# Altium schematic sheet ch347.SchDoc
size A4; SheetNumber: 1; SheetTotal: 1; SPICEModelCacheGGIMXJZP: <root> / <DocumentId>GGIMXJZP</DocumentId> / <CacheFrame Number="0"> / <Model Name="fuse" Kind="CKT"> / <Text>.SUBCKT FUSE 1 2 PARAMS: CURRENT=1 RESISTANCE=1m / SW1 1 2 3 0 SMOD OFF / BNLV 3 0 V=(abs(v(1,2))) / .MODEL SMOD SW (VT={(CURRENT*RESISTANCE)} RON=1g ROFF={RESISTANCE}) / .ENDS FUSE</Text> / </Model> / </CacheFrame> / </root>
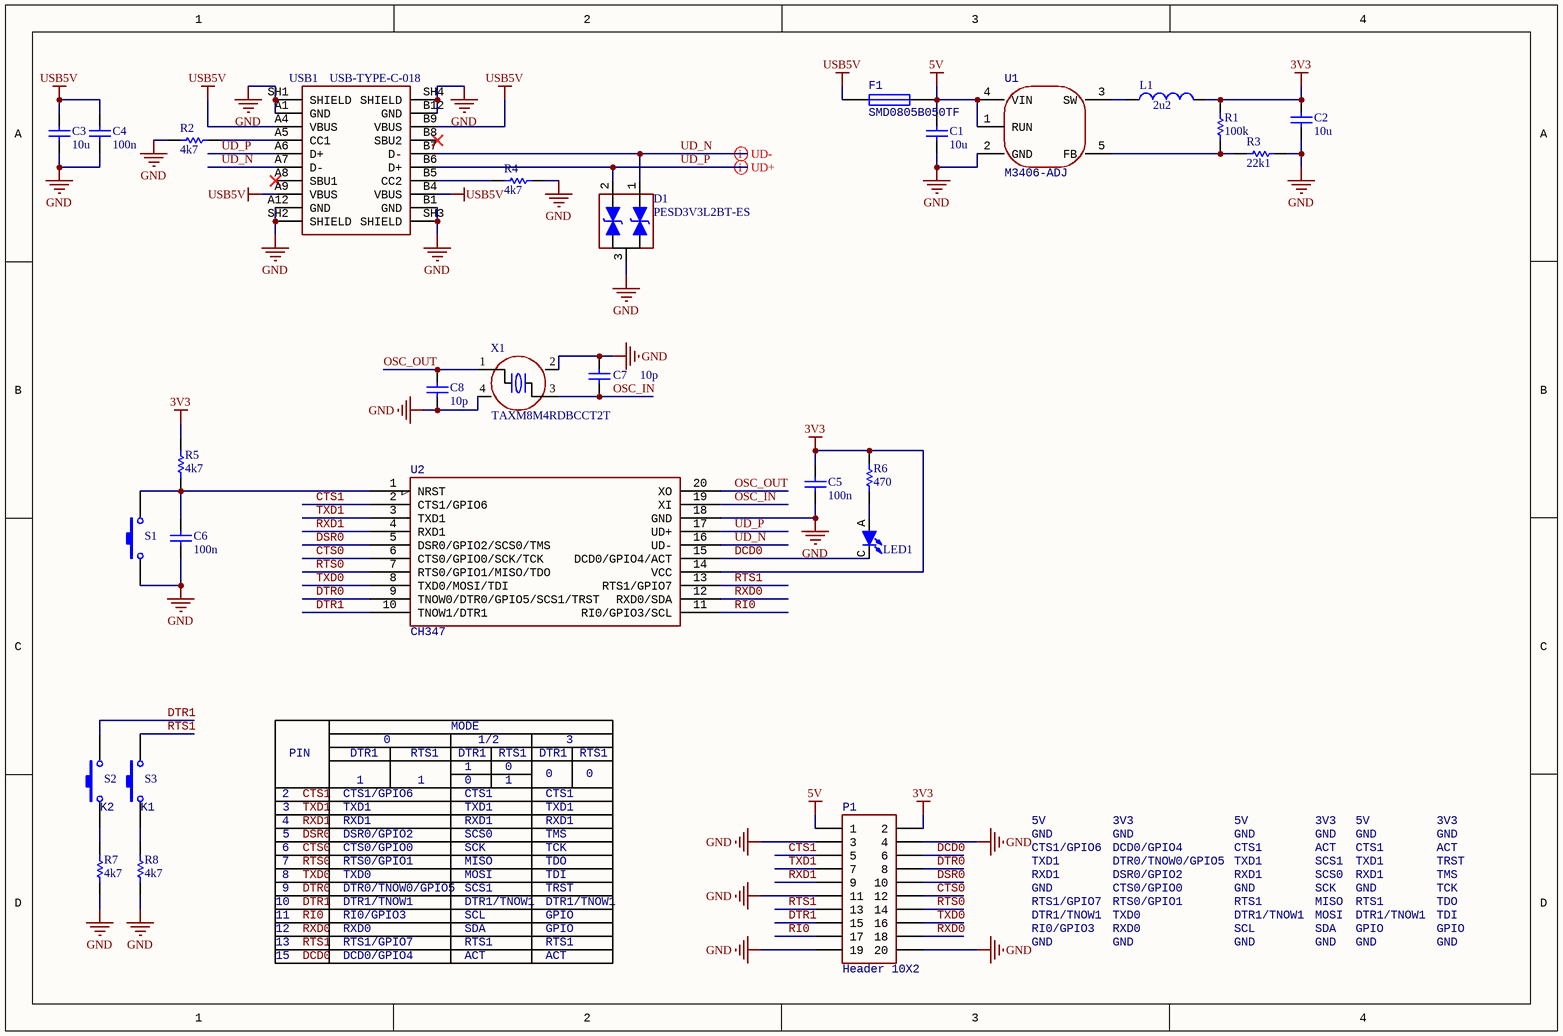
[diagram p0: ch347.SchDoc]

## Parts
C1  value 10u  [CAPC160X80X90L30N]  (hidden comment: Capacitor)
C2  value 10u  [CAPC160X80X90L30N]  (hidden comment: Capacitor)
C3  value 10u  [CAPC160X80X90L30N]  (hidden comment: Capacitor)
C4  value 100n  [CAPC100X50X55L25N]  (hidden comment: Capacitor)
C5  value 100n  [CAPC100X50X55L25N]  (hidden comment: Capacitor)
C6  value 100n  [CAPC100X50X55L25N]  (hidden comment: Capacitor)
C7  value 10p  [CAPC100X50X55L25N]  (hidden comment: Capacitor)
C8  value 10p  [CAPC100X50X55L25N]  (hidden comment: Capacitor)
D1  PESD3V3L2BT-ES  [SOT23-3P95_237X111L52X43N]
F1  SMD0805B050TF  [FUSC210X135X125L37N]
L1  value 2u2  [INDC200X160X105L60N]  (hidden comment: Inductor)
LED1  蓝灯 正贴  [LEDC100X50X45L25N]  (value not drawn)
P1  Header 10X2  [HDRV20W63P254_10X2_2540X508H860]
R1  value 100k  [RESC100X50X35L25N]  (hidden comment: Resistor)
R2  value 4k7  [RESC100X50X35L25N]  (hidden comment: Resistor)
R3  value 22k1  [RESC100X50X35L25N]  (hidden comment: Resistor)
R4  value 4k7  [RESC100X50X35L25N]  (hidden comment: Resistor)
R5  value 4k7  [RESC100X50X35L25N]  (hidden comment: Resistor)
R6  value 470  [RESC100X50X35L25N]  (hidden comment: Resistor)
R7  value 4k7  [RESC100X50X35L25N]  (hidden comment: Resistor)
R8  value 4k7  [RESC100X50X35L25N]  (hidden comment: Resistor)
S1  KEY  [RESRR450W70L600T345H610]  (value not drawn)
S2  KEY  [RESRR450W70L600T345H610]  (value not drawn)
S3  KEY  [RESRR450W70L600T345H610]  (value not drawn)
U1  M3406-ADJ  [SOT23-5P95_280X110L37X40N]
U2  CH347  [SOP20P65_650X640X120L60X24N]
USB1  USB-TYPE-C-018  [USB-TYPE-C-018]
X1  TAXM8M4RDBCCT2T  [OSCCC320X250X80L90X100N]

## Nets
3V3: C2.2 C5.2 L1.2 P1.2 R1.2 R5.1 R6.1 U2.14(VCC)
5V: C1.2 F1.2 P1.1 U1.1(RUN) U1.4(VIN)
GND: C1.1 C2.1 C3.1 C4.1 C5.1 C6.1 C7.2 C8.1 D1.3 P1.3 P1.4 P1.11 P1.19 P1.20 R2.2 R3.1 R4.1 R7.2 R8.2 S1.2 U1.2(GND) U2.18(GND) USB1.A1(GND) USB1.A12(GND) USB1.B1(GND) USB1.B12(GND) USB1.SH1(SHIELD) USB1.SH2(SHIELD) USB1.SH3(SHIELD) USB1.SH4(SHIELD) X1.2(GND) X1.4(GND)
USB5V: C3.2 C4.2 F1.1 USB1.A4(VBUS) USB1.A9(VBUS) USB1.B4(VBUS) USB1.B9(VBUS)
CTS0: P1.12 U2.6(CTS0/GPIO0/SCK/TCK)
CTS1: P1.5 U2.2(CTS1/GPIO6)
DCD0: LED1.C(K) P1.6 U2.15(DCD0/GPIO4/ACT)
DSR0: P1.10 U2.5(DSR0/GPIO2/SCS0/TMS)
DTR0: P1.8 U2.9(TNOW0/DTR0/GPIO5/SCS1/TRST)
DTR1: P1.15 S2.1 U2.10(TNOW1/DTR1)
OSC_IN: C7.1 U2.19(XI) X1.3
OSC_OUT: C8.2 U2.20(XO) X1.1
RI0: P1.17 U2.11(RI0/GPIO3/SCL)
RTS0: P1.14 U2.7(RTS0/GPIO1/MISO/TDO)
RTS1: P1.13 S3.1 U2.13(RTS1/GPIO7)
RXD0: P1.18 U2.12(RXD0/SDA)
RXD1: P1.9 U2.4(RXD1)
TXD0: P1.16 U2.8(TXD0/MOSI/TDI)
TXD1: P1.7 U2.3(TXD1)
UD_N: D1.1 U2.16(UD-) USB1.A7(D-) USB1.B7(D-)
UD_P: D1.2 U2.17(UD+) USB1.A6(D+) USB1.B6(D+)
NetC6_2: C6.2 R5.2 S1.1 U2.1(NRST)
NetL1_1: L1.1 U1.3(SW)
NetLED1_A: LED1.A R6.2
NetR1_1: R1.1 R3.2 U1.5(FB)
NetR2_1: R2.1 USB1.A5(CC1)
NetR4_2: R4.2 USB1.B5(CC2)
NetR7_1: R7.1 S2.2
NetR8_1: R8.1 S3.2

Not connected (* = marked no-connect by the designer): USB1 A8(SBU1)* B8(SBU2)*

## Layout directives
differential pair: UD_N, UD_P

## Notes on the sheet
- PIN
- DTR1
- 1
- 0
- RTS1
- MODE
- 1/2
- 3
- (near S2) K2
- (near S3) K1
- 4
- 6
- 2
- 5
- CTS1/GPIO6
- TXD1
- RXD1
- DSR0/GPIO2
- CTS0/GPIO0
- CTS1
- SCS0
- SCK
- TMS
- TCK
- 5V
- GND
- 3V3
- DCD0/GPIO4
- ACT
- 10
- 11
- 8
- 7
- 9
- RTS0/GPIO1
- TXD0
- DTR0/TNOW0/GPIO5
- DTR1/TNOW1
- RI0/GPIO3
- MISO
- MOSI
- SCS1
- SCL
- TDO
- TDI
- TRST
- GPIO
- RTS1/GPIO7
- 12
- 13
- 15
- RXD0
- SDA
- Labels drawn without touching a wire or pin: CTS0, CTS1, DCD0, DSR0, DTR0, DTR1, RI0, RTS0, RTS1, RXD0, RXD1, TXD0, TXD1

## Library data of the parts
C1-C3 = GRM188R61E106KA73D: MPN: TCC0603X5R106K100CT; Manufacturer: CCTC(三环); 编号: C380314; Case/Package: 0603; Mounting Type: SMD
C4-C6 = GRM188R61E106KA73D: MPN: TCC0402X5R104M250AT; Manufacturer: CCTC(三环); 编号: C359190; Case/Package: 0402; Mounting Type: SMD
C7 C8 = GRM188R61E106KA73D: MPN: CC0402JRNPO9BN100; Manufacturer: YAGEO(国巨); 编号: C106199; Case/Package: 0402; Mounting Type: SMD
D1 = SMC24: 2路双向ESD; Manufacturer: ElecSuper(静芯微); 编号: C5180242
F1 = Fuse 1: Fuse; 编号: C269104
L1 = WPN201610U2R2MTY01: MPN: SFE201610-2R2M; Manufacturer: DDY(德立); 编号: C5159659; Case/Package: 201610; Mounting Type: SMD
LED1 = LED-SMD: 贴片LED; 编号: C965795
P1 = Header 10X2: Header, 10-Pin, Dual row; 编号: C5116480
R1 = RC0402FR-07100KL: MPN: RTT021003FTH; Manufacturer: RALEC(旺诠); 编号: C102750; Case/Package: 0402; Mounting Type: SMD
R2 R4 R5 R7 R8 = RC0402FR-07100KL: MPN: RTT02472JTH; Manufacturer: RALEC(旺诠); 编号: C103059; Case/Package: 0402; Mounting Type: SMD
R3 = RC0402FR-0722K1L: MPN: RTT022212FTH; Manufacturer: RALEC(旺诠); 编号: C102896; Case/Package: 0402; Mounting Type: SMD
R6 = RC0402FR-07100KL: MPN: RTT02471JTH; Manufacturer: RALEC(旺诠); 编号: C103058; Case/Package: 0402; Mounting Type: SMD
S1-S3 = SW-PB: Switch; 编号: C2888565; Revision: July-2002: Re-released for DXP Platform.
U1 = M3406-ADJ: Vin=2V~6V,800mA,DCDC; Manufacturer: 西安航天民芯; 编号: C83224; MPN: M3406-ADJ; Mounting Type: SMD
U2 = CH347: 编号: C5122332
USB1 = USB-TYPE-C-018: 编号: C2927038
X1 = X32258MSB4SI: 8MHz ±10ppm 10pF; Manufacturer: TAE(雅晶鑫); 编号: C400090